# EAGLE board Attenuverting_LinExp_VCA (EAGLE 7.7.0), part 1 of 2
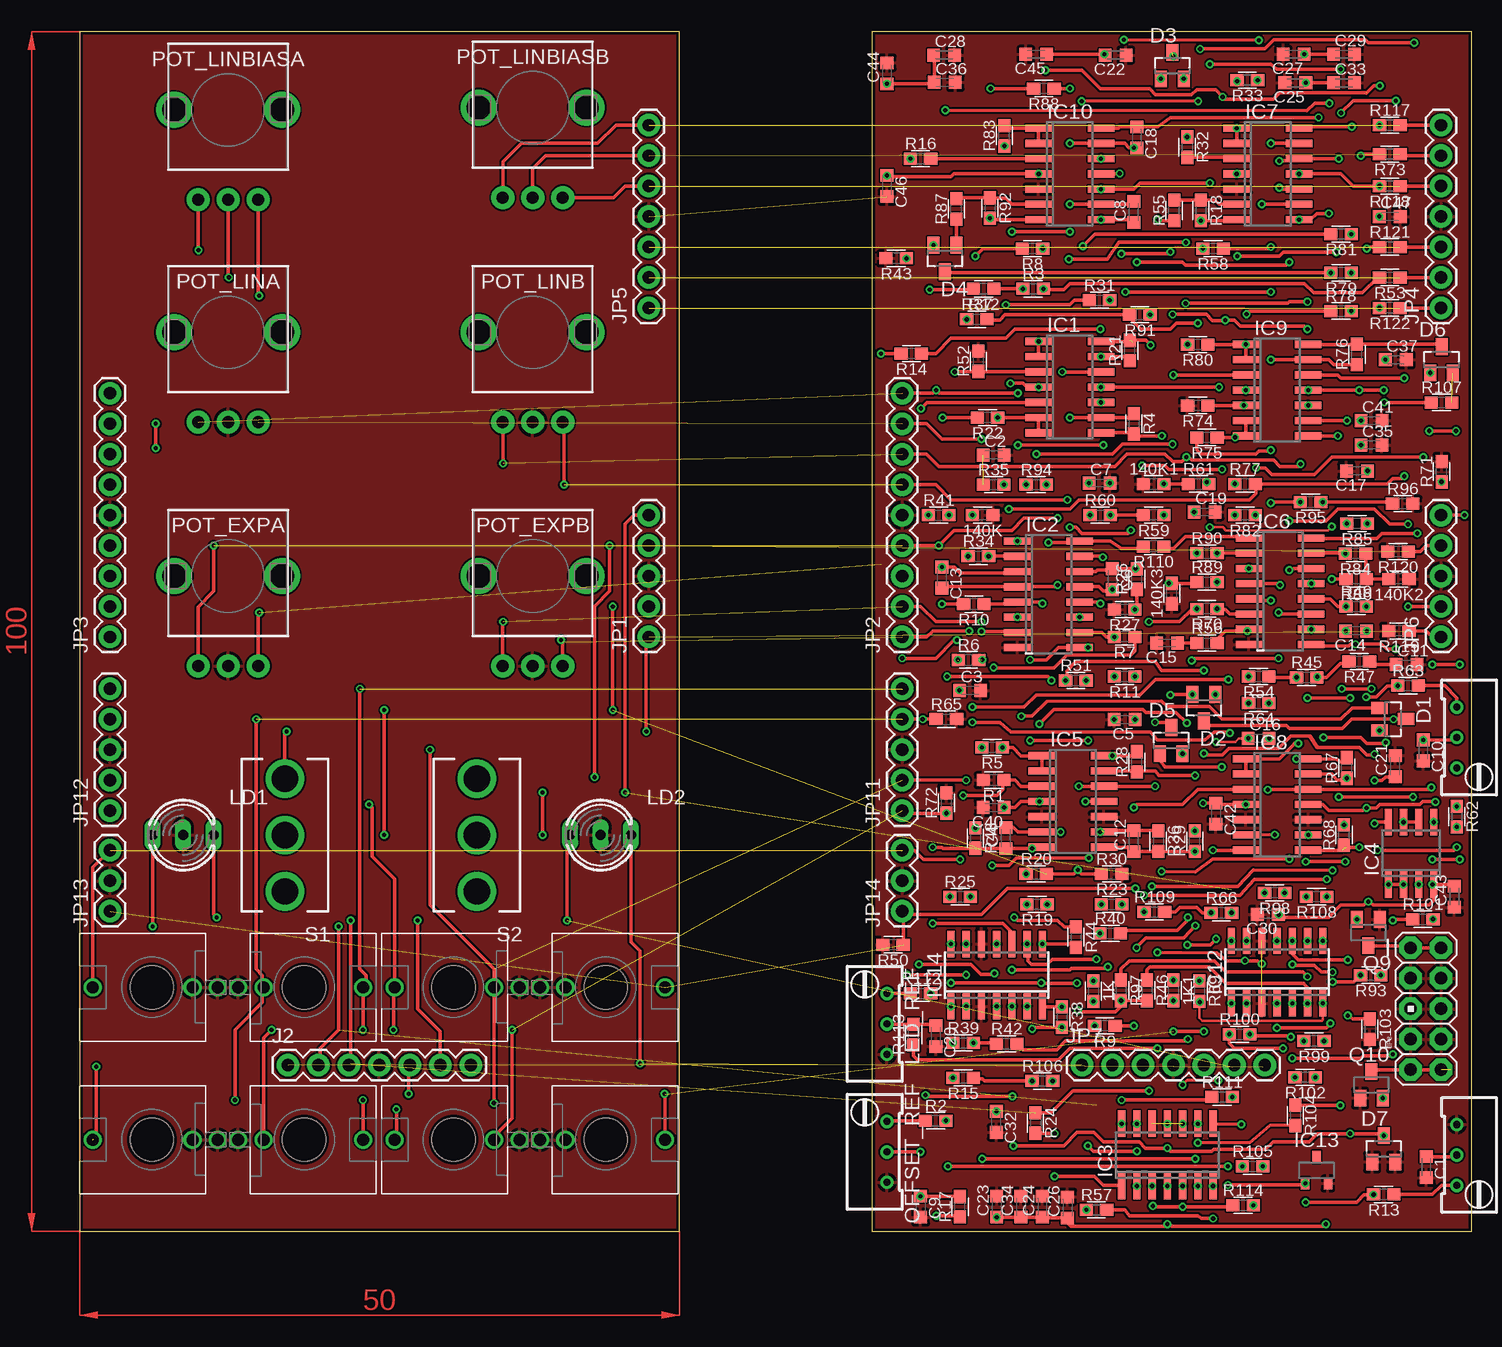
[diagram p6: board, top side]
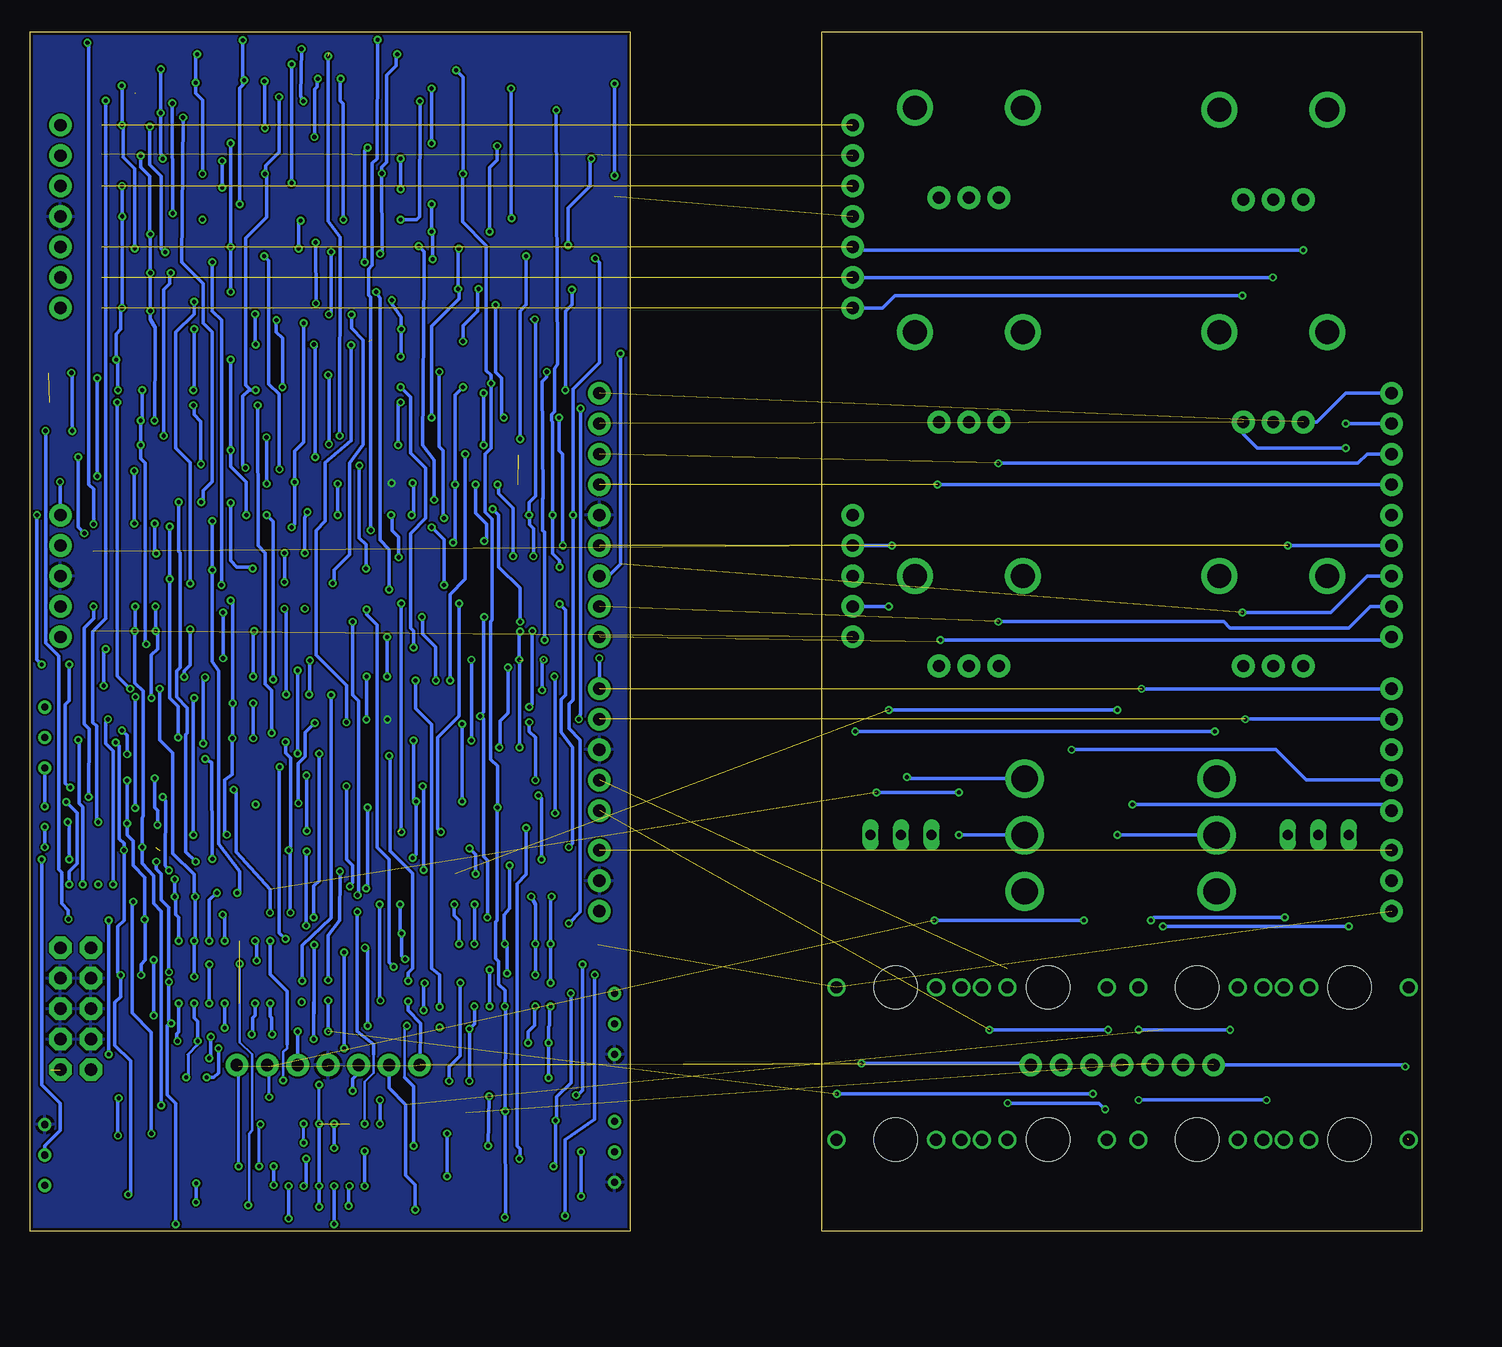
[diagram p7: board, bottom side, seen from below]

Size 116.04 x 100 mm. Coordinates in mm from the lower left corner, seen from the top.
Outline: 0,0 50,0 50,100 0,100 0,0
Outline: 66.04,0 116.04,0 116.04,100 66.04,100 66.04,0
Copper layers (1*16): Top 0.035mm / dielectric 1.5mm / Bottom 0.035mm
Design rules "SeeedStudio_2layer_DRU_no_angle_20140221": minimum track width 6mil, minimum drill 12mil, track to track 6mil, track to pad 6mil, pad to pad 6mil, via to via 6mil, smd to smd 0mil, copper to edge 10mil, drill to drill 10mil, minimum pad ring 10mil, minimum via ring 6mil, stop-mask expansion 2mil, vias tented up to drill 100mil, thermal gap 10mil

## Footprints (pad centres in the part's own frame; a part is rotated, then mirrored left to right if it is on the bottom)
0603 = smd 1.1 x 1: 1 -0.85,0; 2 0.85,0
C0603K = smd 1.05 x 1.08: 1 -0.875,0; 2 0.875,0
RTRIM64W = drill 0.61: 1 1.27,-2.54; 2 1.27,0; 3 1.27,2.54
THONKICONN = drill 1: P$1 0,-5.5; P$2 0,-3.38; P$3 0,4.92 | hole 3.6: 0,0
SOT23 = smd 1 x 1.4: 1 -0.95,-1.1; 2 0.95,-1.1; 3 0,1.1
SO14 = smd 0.6 x 2.2: 1 -3.81,-2.6; 2 -2.54,-2.6; 3 -1.27,-2.6; 4 0,-2.6; 5 1.27,-2.6; 6 2.54,-2.6; 7 3.81,-2.6; 8 3.81,2.6; 9 2.54,2.6; 10 1.27,2.6; 11 0,2.6; 12 -1.27,2.6; 13 -2.54,2.6; 14 -3.81,2.6
SOIC16N = smd 0.6 x 2.2: 1 -4.445,-2.6; 2 -3.175,-2.6; 3 -1.905,-2.6; 4 -0.635,-2.6; 5 0.635,-2.6; 6 1.905,-2.6; 7 3.175,-2.6; 8 4.445,-2.6; 9 4.445,2.6; 10 3.175,2.6; 11 1.905,2.6; 12 0.635,2.6; 13 -0.635,2.6; 14 -1.905,2.6; 15 -3.175,2.6; 16 -4.445,2.6
SO08 = smd 0.6 x 2.2: 1 -1.905,-2.6; 2 -0.635,-2.6; 3 0.635,-2.6; 4 1.905,-2.6; 5 1.905,2.6; 6 0.635,2.6; 7 -0.635,2.6; 8 -1.905,2.6
DBZ_R-PDSO-G3 = smd 0.7 x 1: 1 -0.95,-1.1; 2 0.95,-1.1; 3 0,1.1
1X07 = drill 1.016 pad 1.88: 1 0,0; 2 2.54,0; 3 5.08,0; 4 7.62,0; 5 10.16,0; 6 12.7,0; 7 15.24,0
1X05 = drill 1.016 pad 1.88: 1 0,0; 2 2.54,0; 3 5.08,0; 4 7.62,0; 5 10.16,0
1X09 = drill 1.016 pad 1.88: 1 0,0; 2 2.54,0; 3 5.08,0; 4 7.62,0; 5 10.16,0; 6 12.7,0; 7 15.24,0; 8 17.78,0; 9 20.32,0
AVR_ICSP = drill 1.016 pad 1.88 octagon: 1 -1.27,5.08; 2 1.27,5.08; 3 -1.27,2.54; 4 1.27,2.54; 5 -1.27,0; 6 1.27,0; 7 -1.27,-2.54; 8 1.27,-2.54; 9 -1.27,-5.08; 10 1.27,-5.08
1X03 = drill 1.016 pad 1.88: 1 0,0; 2 2.54,0; 3 5.08,0
DUOLED-C-5MM = drill 0.813 long: AR 2.54,0; AX -2.54,0; C 0,0
POT-ALPS-RK09L1140 = drill 1 pad 1.93: 1 -2.5,-7.5; 2 0,-7.5; 3 2.5,-7.5 | drill 2: P$5 -4.5,0; P$6 4.5,0
SWITCH-SPDT-SALECOM-T8014 = drill 2.2: 1 0,4.699; 2 0,0; 3 0,-4.699

## Placement (x,y rotation side)
1K  1k  [0603]  84.52,20 270 top
1K1  1k  [0603]  91.19,20.07 270 top
140K  100k  [0603]  75.28,59.69 180 top
140K1  100k  [0603]  89.53,62.29 0 top
140K2  100k  [0603]  109.98,54.36 180 top
140K3  100k  [0603]  91.06,53.15 90 top
C1  4u7  [C0603K]  112.27,5.33 270 top
C2  560p  [C0603K]  76.2,64.71 0 top
C3  560p  [C0603K]  74.23,45.09 0 top
C4  100p  [C0603K]  77.22,32.77 90 top
C5  560p  [C0603K]  87.12,42.64 180 top
C6  100p  [C0603K]  86.11,54.36 270 top
C7  560p  [C0603K]  85.03,62.36 0 top
C8  100p  [C0603K]  87.88,84.96 90 top
C9  4u7  [C0603K]  70.1,2.03 270 top
C10  4u7  [C0603K]  112.01,40.07 270 top
C11  560p  [C0603K]  110.62,47.24 0 top
C12  100p  [C0603K]  87.88,32.51 90 top
C13  100p  [C0603K]  71.88,54.48 270 top
C14  100p  [C0603K]  106.43,50.04 180 top
C15  560p  [C0603K]  90.68,49.02 180 top
C16  100p  [C0603K]  98.3,41.08 0 top
C17  560p  [C0603K]  106.49,63.37 180 top
C18  100p  [C0603K]  88.14,91.19 270 top
C19  560p  [C0603K]  93.79,59.94 0 top
C20  4u7  [C0603K]  71.37,16.26 270 top
C21  100n  [C0603K]  109.66,38.77 90 top
C22  100n  [C0603K]  86.36,98.04 180 top
C23  100n  [C0603K]  76.45,2.03 90 top
C24  100n  [C0603K]  80.26,2.03 90 top
C25  100n  [C0603K]  101.35,95.73 180 top
C26  100n  [C0603K]  82.36,1.97 90 top
C27  100n  [C0603K]  101.22,98.11 180 top
C28  100n  [C0603K]  72.07,98.04 0 top
C29  100n  [C0603K]  105.41,98.11 0 top
C30  100n  [C0603K]  99.06,26.42 180 top
C32  100n  [C0603K]  76.42,9.11 270 top
C33  100n  [C0603K]  105.41,95.73 0 top
C34  100n  [C0603K]  78.49,2.03 90 top
C35  100n  [C0603K]  107.7,65.53 0 top
C36  100n  [C0603K]  72.14,95.76 0 top
C37  100n  [C0603K]  109.73,72.64 0 top
C40  100n  [C0603K]  76.2,35.31 180 top
C41  100n  [C0603K]  107.7,67.56 0 top
C42  100n  [C0603K]  94.74,34.8 270 top
C43  100n  [C0603K]  114.62,27.88 90 top
C44  100n  [C0603K]  67.31,96.52 90 top
C45  100n  [C0603K]  79.76,98.11 180 top
C46  100n  [C0603K]  67.31,87.12 270 top
C47  100n  [C0603K]  109.22,84.58 0 top
CLAMP_REF  [RTRIM64W]  116.08,41.15 180 top
CV_EXP_A  THONKICONN  [THONKICONN]  18.73,7.62 270 top
CV_EXP_B  THONKICONN  [THONKICONN]  31.18,7.62 90 top
CV_LIN_A  THONKICONN  [THONKICONN]  18.73,20.32 270 top
CV_LIN_B  THONKICONN  [THONKICONN]  31.18,20.32 90 top
D1  BAT54A  [SOT23]  109.47,42.67 270 top
D2  BAT54A  [SOT23]  93.73,43.62 180 top
D3  BAT54S  [SOT23]  91.09,97.16 0 top
D4  BAT54S  [SOT23]  72.14,81.09 180 top
D5  BAT54S  [SOT23]  91,40.89 0 top
D6  BAT54S  [SOT23]  113.54,72.64 0 top
D7  BAT54A  [SOT23]  108.71,6.86 0 top
IC1  TL074D  [SO14]  82.55,70.36 270 top
IC2  SSM2164S  [SOIC16N]  80.77,53.09 270 top
IC3  TL074D  [SO14]  90.68,6.35 0 top
IC4  TL072D  [SO08]  111,31.5 0 top
IC5  TL074D  [SO14]  82.8,35.81 270 top
IC6  SSM2164S  [SOIC16N]  100.08,53.34 270 top
IC7  TL074D  [SO14]  99.06,88.14 270 top
IC8  TL074D  [SO14]  99.82,35.56 270 top
IC9  TL074D  [SO14]  99.82,70.1 270 top
IC10  TL074D  [SO14]  82.55,88.14 270 top
IC12  QUAD_OPAMPD  [SO14]  99.82,21.59 0 top
IC13  LM4041C12DBZ  [DBZ_R-PDSO-G3]  103.12,5.08 0 top
IC14  QUAD_OPAMPD  [SO14]  76.45,21.34 0 top
IN_A  THONKICONN  [THONKICONN]  6.03,20.32 90 top
IN_B  THONKICONN  [THONKICONN]  43.88,20.32 270 top
J2  [1X07]  17.37,13.84 0 top
JP1  [1X05]  47.46,49.53 90 top
JP2  M09  [1X09]  68.58,49.53 90 top
JP3  M09  [1X09]  2.54,49.53 90 top
JP4  [1X07]  113.5,76.96 90 top
JP5  [1X07]  47.46,76.96 90 top
JP6  [1X05]  113.5,49.53 90 top
JP7  [1X07]  83.57,13.84 0 top
JP8  M05X2PTH  [AVR_ICSP]  112.23,18.54 0 top
JP11  [1X05]  68.58,35.05 90 top
JP12  [1X05]  2.54,35.05 90 top
JP13  [1X03]  2.54,26.67 90 top
JP14  [1X03]  68.58,26.67 90 top
LD1  [DUOLED-C-5MM]  8.64,33.02 0 top
LD2  [DUOLED-C-5MM]  43.43,33.02 0 top
LED_REF  [RTRIM64W]  66.04,17.27 0 top
OFFSET_LINA  [RTRIM64W]  116.08,6.35 180 top
OFFSET_REF  [RTRIM64W]  66.04,6.6 0 top
OUT_A  THONKICONN  [THONKICONN]  6.03,7.62 90 top
OUT_B  THONKICONN  [THONKICONN]  43.88,7.62 270 top
POT_EXPA  POT-ALPS-RK09L1140  [POT-ALPS-RK09L1140]  12.38,54.61 0 top
POT_EXPB  POT-ALPS-RK09L1140  [POT-ALPS-RK09L1140]  37.78,54.61 0 top
POT_LINA  POT-ALPS-RK09L1140  [POT-ALPS-RK09L1140]  12.38,74.93 0 top
POT_LINB  POT-ALPS-RK09L1140  [POT-ALPS-RK09L1140]  37.78,74.93 0 top
POT_LINBIASA  POT-ALPS-RK09L1140  [POT-ALPS-RK09L1140]  12.38,93.47 0 top
POT_LINBIASB  POT-ALPS-RK09L1140  [POT-ALPS-RK09L1140]  37.78,93.66 0 top
Q9  BSS84  [SOT23]  107.44,24.89 180 top
Q10  BSS123  [SOT23]  107.7,12.19 0 top
R1  1M  [0603]  76.2,37.59 180 top
R2  10k  [0603]  71.37,9.21 0 top
R3  10k  [0603]  79.5,78.55 0 top
R4  10k  [0603]  87.88,67.31 270 top
R5  30k  [0603]  76.07,40.32 180 top
R6  500  [0603]  74.1,47.62 0 top
R7  30k  [0603]  87.12,49.53 180 top
R8  4k7  [0603]  79.44,81.92 180 top
R9  10k  [0603]  85.47,17.11 180 top
R10  30k  [0603]  74.55,52.26 180 top
R11  500  [0603]  87.12,46.23 180 top
R12  10k  [0603]  75.37,78.55 180 top
R13  10k  [0603]  108.71,3.05 180 top
R14  4k7  [0603]  69.34,73.15 180 top
R15  100k  [0603]  73.66,12.76 180 top
R16  100k  [0603]  70.1,89.41 0 top
R17  10k  [0603]  73.41,2.03 90 top
R18  100k  [0603]  93.47,85.09 270 top
R19  100k  [0603]  79.82,27.24 180 top
R20  10k  [0603]  79.76,29.78 0 top
R21  10k  [0603]  87.57,73.41 90 top
R22  10k  [0603]  75.69,67.82 180 top
R23  100k  [0603]  86.04,27.24 0 top
R24  2k7  [0603]  79.69,9.02 270 top
R25  10k  [0603]  73.41,27.88 0 top
R26  100k  [0603]  88.14,54.36 90 top
R27  100k  [0603]  87.12,51.82 180 top
R28  10k  [0603]  88.14,39.12 90 top
R29  10k  [0603]  92.96,32.51 90 top
R30  10k  [0603]  86.04,29.78 0 top
R31  10k  [0603]  85.03,77.6 0 top
R32  100k  [0603]  92.33,90.36 270 top
R33  100k  [0603]  97.35,95.95 180 top
R34  140k  [0603]  74.93,56.26 0 top
R35  500  [0603]  76.2,62.23 0 top
R36  30k  [0603]  89.92,32.51 270 top
R37  100k  [0603]  74.8,76.01 0 top
R38  100k  [0603]  81.88,17.84 270 top
R39  100k  [0603]  73.66,15.68 0 top
R40  100k  [0603]  85.92,24.83 0 top
R41  100k  [0603]  71.63,59.69 0 top
R42  100k  [0603]  77.28,15.62 0 top
R43  100k  [0603]  68.07,81.09 180 top
R44  560  [0603]  83.06,24.51 270 top
R45  30k  [0603]  102.3,46.16 0 top
R46  100k  [0603]  88.96,20.07 270 top
R47  500  [0603]  106.68,47.5 180 top
R48  10k  [0603]  74.68,32.77 270 top
R49  30k  [0603]  106.43,52.07 0 top
R50  1M  [0603]  67.82,23.88 180 top
R51  560  [0603]  83.06,45.91 0 top
R52  1M  [0603]  74.93,72.52 90 top
R53  10k  [0603]  109.22,79.5 180 top
R54  30k  [0603]  98.3,46.23 180 top
R55  100k  [0603]  91.25,85.09 90 top
R56  500  [0603]  93.98,49.02 0 top
R57  2k7  [0603]  84.77,1.78 0 top
R58  100k  [0603]  94.49,81.92 180 top
R59  140k  [0603]  89.53,59.69 180 top
R60  500  [0603]  85.09,59.69 0 top
R61  100k  [0603]  93.28,62.29 0 top
R62  10k  [0603]  114.81,34.54 270 top
R63  10k  [0603]  110.74,45.47 0 top
R64  30k  [0603]  98.3,44.01 180 top
R65  1M  [0603]  72.26,42.67 0 top
R66  10k  [0603]  95.19,26.54 0 top
R67  10k  [0603]  105.63,38.61 90 top
R68  10k  [0603]  105.41,33.02 90 top
R69  560  [0603]  93.34,20 270 top
R70  560  [0603]  93.98,51.88 180 top
R71  10k  [0603]  113.54,63.31 90 top
R72  1M  [0603]  72.26,35.69 90 top
R73  10k  [0603]  109.22,89.79 180 top
R74  1M  [0603]  93.22,68.83 180 top
R75  10k  [0603]  93.98,66.17 180 top
R76  10k  [0603]  106.49,73.09 90 top
R77  10k  [0603]  97.16,62.29 0 top
R78  10k  [0603]  105.16,76.71 0 top
R79  10k  [0603]  105.16,79.88 180 top
R80  10k  [0603]  93.22,73.91 180 top
R81  4k7  [0603]  105.16,83.12 180 top
R82  4k7  [0603]  97.16,59.69 180 top
R83  100k  [0603]  77.09,91.31 90 top
R84  140k  [0603]  106.36,56.48 180 top
R85  500  [0603]  106.49,58.99 180 top
R86  100k  [0603]  106.43,54.36 180 top
R87  100k  [0603]  73.09,85.22 90 top
R88  100k  [0603]  80.39,95.25 180 top
R89  140k  [0603]  93.98,54.1 0 top
R90  500  [0603]  93.98,56.52 0 top
R91  100k  [0603]  88.39,76.39 180 top
R92  100k  [0603]  75.88,85.28 270 top
R93  510  [0603]  107.63,21.34 180 top
R94  6k  [0603]  79.76,62.23 0 top
R95  100k  [0603]  102.62,60.77 180 top
R96  100k  [0603]  110.3,60.64 0 top
R97  100k  [0603]  86.8,20.07 270 top
R98  100k  [0603]  99.63,28.19 180 top
R99  100k  [0603]  102.9,15.84 180 top
R100  100k  [0603]  96.71,16.41 0 top
R101  100k  [0603]  111.98,26 0 top
R102  100k  [0603]  102.17,12.83 180 top
R103  100k  [0603]  107.57,16.83 270 top
R104  10k  [0603]  101.35,9.65 270 top
R105  2k7  [0603]  97.79,5.4 0 top
R106  100k  [0603]  80.26,12.51 0 top
R107  100k  [0603]  113.54,69.09 0 top
R108  100k  [0603]  103.12,27.88 180 top
R109  10k  [0603]  89.6,26.61 0 top
R110  6k  [0603]  89.53,57.09 180 top
R111  2k7  [0603]  95.25,11.18 0 top
R112  10k  [0603]  70.1,19.81 0 top
R113  10k  [0603]  69.53,16.38 90 top
R114  10k  [0603]  97,2.16 0 top
R117  10k  [0603]  109.22,92.2 0 top
R118  10k  [0603]  109.22,87.12 180 top
R119  10k  [0603]  109.98,50.04 180 top
R120  10k  [0603]  109.92,56.64 180 top
R121  10k  [0603]  109.22,82.04 0 top
R122  10k  [0603]  109.22,76.96 180 top
S1  [SWITCH-SPDT-SALECOM-T8014]  17.12,33.02 180 top
S2  [SWITCH-SPDT-SALECOM-T8014]  33.12,33.02 180 top